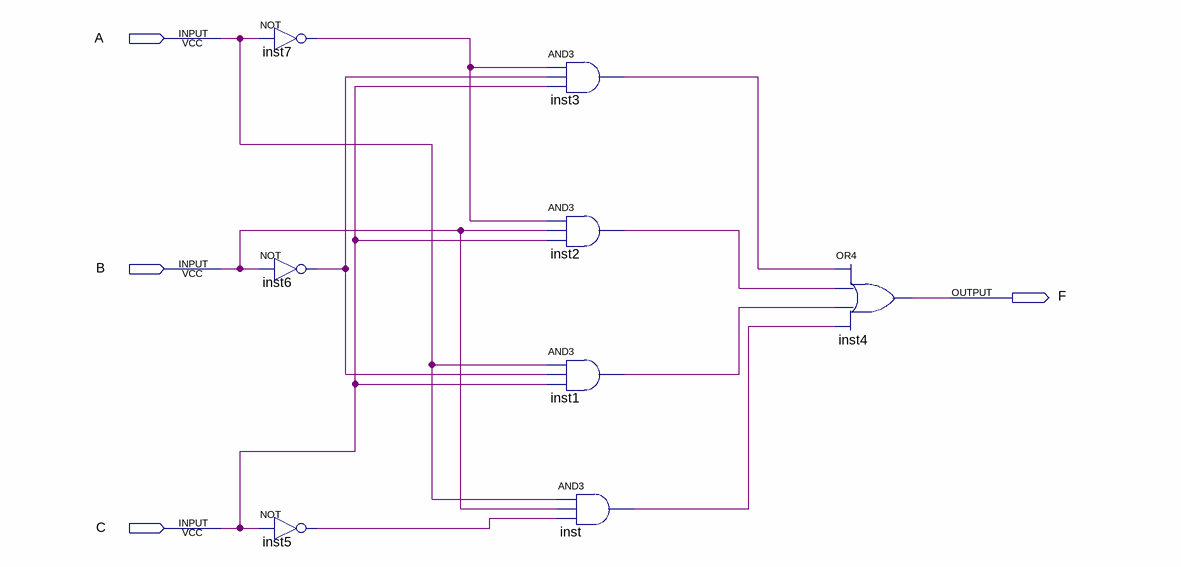
[diagram p0: schematic sheet]
// Quartus schematic lab1step3.bdf as structural Verilog: 8 symbols, 4 pins
module lab1step3 (
  input  A,
  input  B,
  input  C,
  output F
);

  wire inst1_out, inst2_out, inst3_out, inst5_out, inst6_out, inst7_out, inst_out;

  not inst7 (inst7_out, A);
  not inst6 (inst6_out, B);
  not inst5 (inst5_out, C);
  and inst3 (inst3_out, inst7_out, inst6_out, C);
  and inst2 (inst2_out, inst7_out, B, C);
  and inst1 (inst1_out, A, inst6_out, C);
  and inst (inst_out, A, B, inst5_out);
  or inst4 (F, inst3_out, inst2_out, inst1_out, inst_out);
endmodule
